# Altium schematic sheet Chip_v1_unevenFootprint.SchDoc
size A4; SheetNumber: 2; SheetTotal: 3
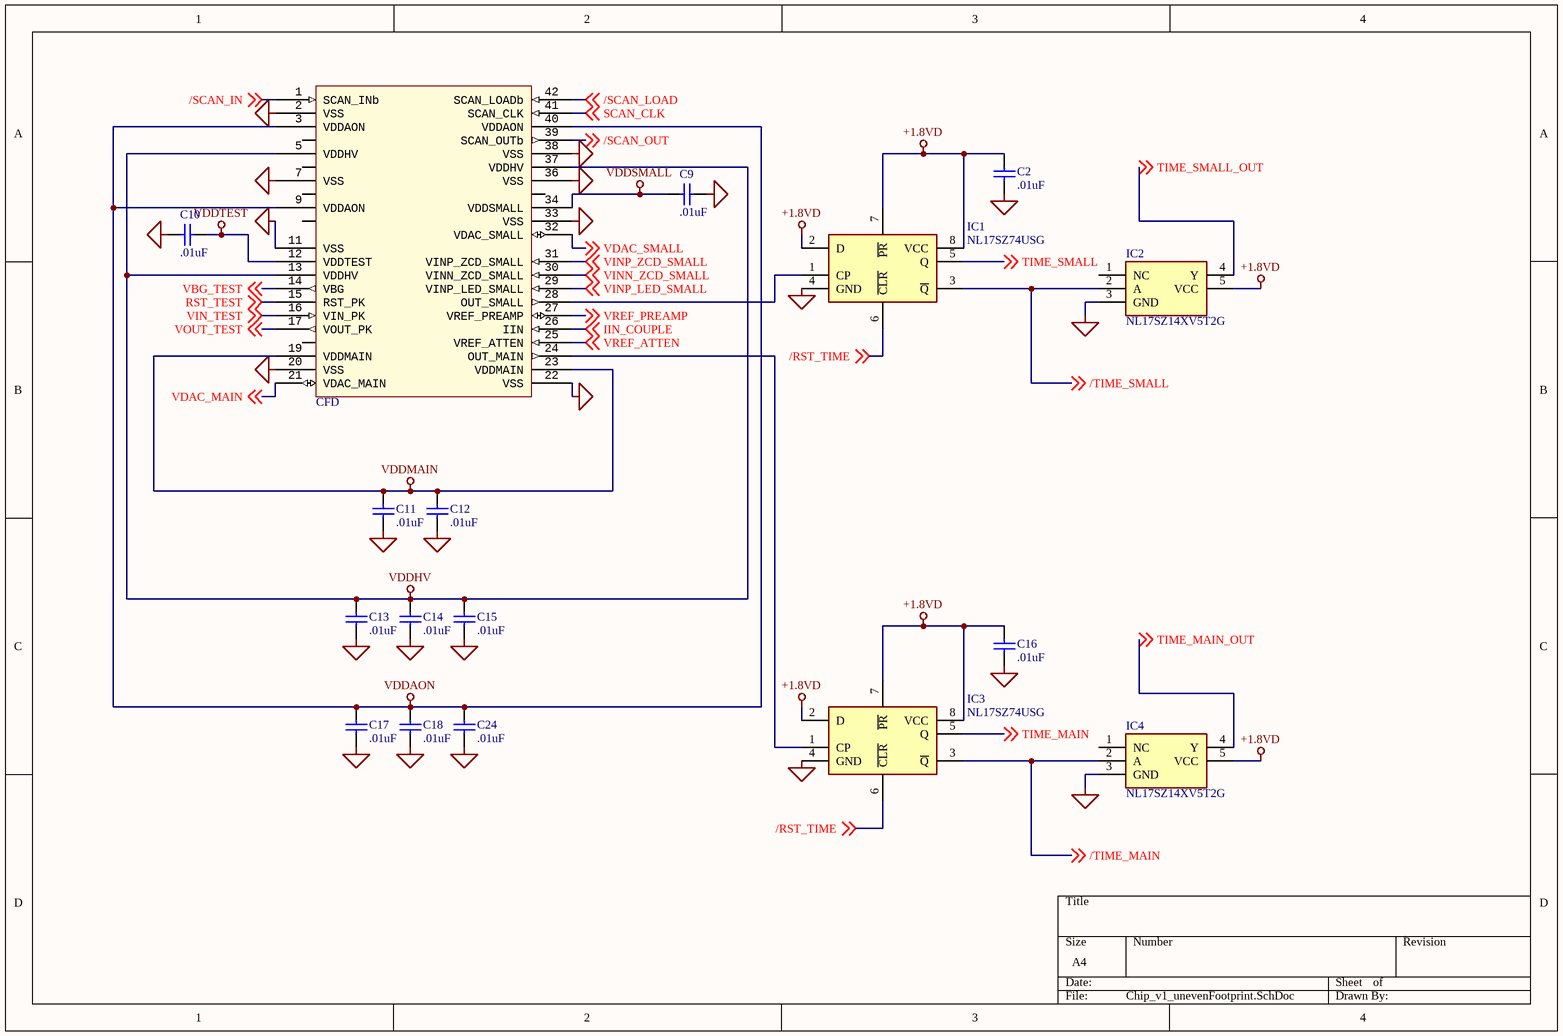
[diagram p0: Chip_v1_unevenFootprint.SchDoc]

## Parts
C2  .01uF  [CAPC2013X140X45NL15T25]
C9  .01uF  [CAPC2013X140X45NL15T25]
C10  .01uF  [CAPC2013X140X45NL15T25]
C11  .01uF  [CAPC2013X140X45NL15T25]
C12  .01uF  [CAPC2013X140X45NL15T25]
C13  .01uF  [CAPC2013X140X45NL15T25]
C14  .01uF  [CAPC2013X140X45NL15T25]
C15  .01uF  [CAPC2013X140X45NL15T25]
C16  .01uF  [CAPC2013X140X45NL15T25]
C17  .01uF  [CAPC2013X140X45NL15T25]
C18  .01uF  [CAPC2013X140X45NL15T25]
C24  .01uF  [CAPC2013X140X45NL15T25]
CHIP1  CFD  [QFN50P700X700X80_HS-43N]
IC1  NL17SZ74USG  [SOP50P310X90-8N]
IC2  NL17SZ14XV5T2G  [SOTFL50P160X60-5N]
IC3  NL17SZ74USG  [SOP50P310X90-8N]
IC4  NL17SZ14XV5T2G  [SOTFL50P160X60-5N]

## Nets
+1.8VD: C2.2 C16.2 IC1.2(D) IC1.7(~{PR}) IC1.8(VCC) IC2.5(VCC) IC3.2(D) IC3.7(~{PR}) IC3.8(VCC) IC4.5(VCC)
GND: C2.1 C9.1 C10.1 C11.1 C12.1 C13.1 C14.1 C15.1 C16.1 C17.1 C18.1 C24.1 CHIP1.2(VSS) CHIP1.7(VSS) CHIP1.11(VSS) CHIP1.20(VSS) CHIP1.22(VSS) CHIP1.33(VSS) CHIP1.36(VSS) CHIP1.38(VSS) IC1.4(GND) IC2.3(GND) IC3.4(GND) IC4.3(GND)
VDDAON: C17.2 C18.2 C24.2 CHIP1.3(VDDAON) CHIP1.9(VDDAON) CHIP1.40(VDDAON)
VDDHV: C13.2 C14.2 C15.2 CHIP1.5(VDDHV) CHIP1.13(VDDHV) CHIP1.37(VDDHV)
VDDMAIN: C11.2 C12.2 CHIP1.19(VDDMAIN) CHIP1.23(VDDMAIN)
VDDSMALL: C9.2 CHIP1.34(VDDSMALL)
VDDTEST: C10.2 CHIP1.12(VDDTEST)
/RST_TIME: IC1.6(~{CLR}) IC3.6(~{CLR}) ; off-sheet /RST_TIME
/SCAN_IN: CHIP1.1(SCAN_INb) ; off-sheet /SCAN_IN
/SCAN_LOAD: CHIP1.42(SCAN_LOADb) ; off-sheet /SCAN_LOAD
/SCAN_OUT: CHIP1.39(SCAN_OUTb) ; off-sheet /SCAN_OUT
/TIME_MAIN: IC3.3(~{Q}) IC4.2(A) ; off-sheet /TIME_MAIN
/TIME_SMALL: IC1.3(~{Q}) IC2.2(A) ; off-sheet /TIME_SMALL
IIN_COUPLE: CHIP1.26(IIN) ; off-sheet IIN_COUPLE
RST_TEST: CHIP1.15(RST_PK) ; off-sheet RST_TEST
SCAN_CLK: CHIP1.41(SCAN_CLK) ; off-sheet SCAN_CLK
TIME_MAIN: IC3.5(Q) ; off-sheet TIME_MAIN
TIME_MAIN_OUT: IC4.4(Y) ; off-sheet TIME_MAIN_OUT
TIME_SMALL: IC1.5(Q) ; off-sheet TIME_SMALL
TIME_SMALL_OUT: IC2.4(Y) ; off-sheet TIME_SMALL_OUT
VBG_TEST: CHIP1.14(VBG) ; off-sheet VBG_TEST
VDAC_MAIN: CHIP1.21(VDAC_MAIN) ; off-sheet VDAC_MAIN
VDAC_SMALL: CHIP1.32(VDAC_SMALL) ; off-sheet VDAC_SMALL
VIN_TEST: CHIP1.16(VIN_PK) ; off-sheet VIN_TEST
VINN_ZCD_SMALL: CHIP1.30(VINN_ZCD_SMALL) ; off-sheet VINN_ZCD_SMALL
VINP_LED_SMALL: CHIP1.29(VINP_LED_SMALL) ; off-sheet VINP_LED_SMALL
VINP_ZCD_SMALL: CHIP1.31(VINP_ZCD_SMALL) ; off-sheet VINP_ZCD_SMALL
VOUT_TEST: CHIP1.17(VOUT_PK) ; off-sheet VOUT_TEST
VREF_ATTEN: CHIP1.25(VREF_ATTEN) ; off-sheet VREF_ATTEN
VREF_PREAMP: CHIP1.27(VREF_PREAMP) ; off-sheet VREF_PREAMP
NetCHIP1_24: CHIP1.24(OUT_MAIN) IC3.1(CP)
NetCHIP1_28: CHIP1.28(OUT_SMALL) IC1.1(CP)

Not connected (* = marked no-connect by the designer): CHIP1 4 6 8 10 18 35; IC2 1(NC); IC4 1(NC)

## Library data of the parts
C2 C9-C18 C24 = CMP-2007-03395-1: 0402; Part Number: GRM21BR71A106KE51L; Manufacturer: Murata
IC1 IC3 = NL17SZ74USG: Flip Flops 1.65-5.5V CMOS Single D-Type; Manufacturer_Name: ON Semiconductor; Datasheet Link: http://www.onsemi.com/pub/Collateral/NL17SZ74-D.PDF; Height: 0.9mm; Manufacturer_Part_Number: NL17SZ74USG
IC2 IC4 = NL17SZ14XV5T2G: Integrated Circuit; Manufacturer_Name: ON Semiconductor; Datasheet Link: https://componentsearchengine.com//NL17SZ14XV5T2G.pdf; Height: 0.6mm; Mouser2 Part Number: 863-NL17SZ14XV5T2G; Mouser2 Price/Stock: https://www.mouser.com/Search/Refine.aspx?Keyword=863-NL17SZ14XV5T2G; Manufacturer_Part_Number: NL17SZ14XV5T2G